# Altium schematic sheet WSN_project_Gateway.SchDoc
size A4; SheetNumber: 1; SheetTotal: 1
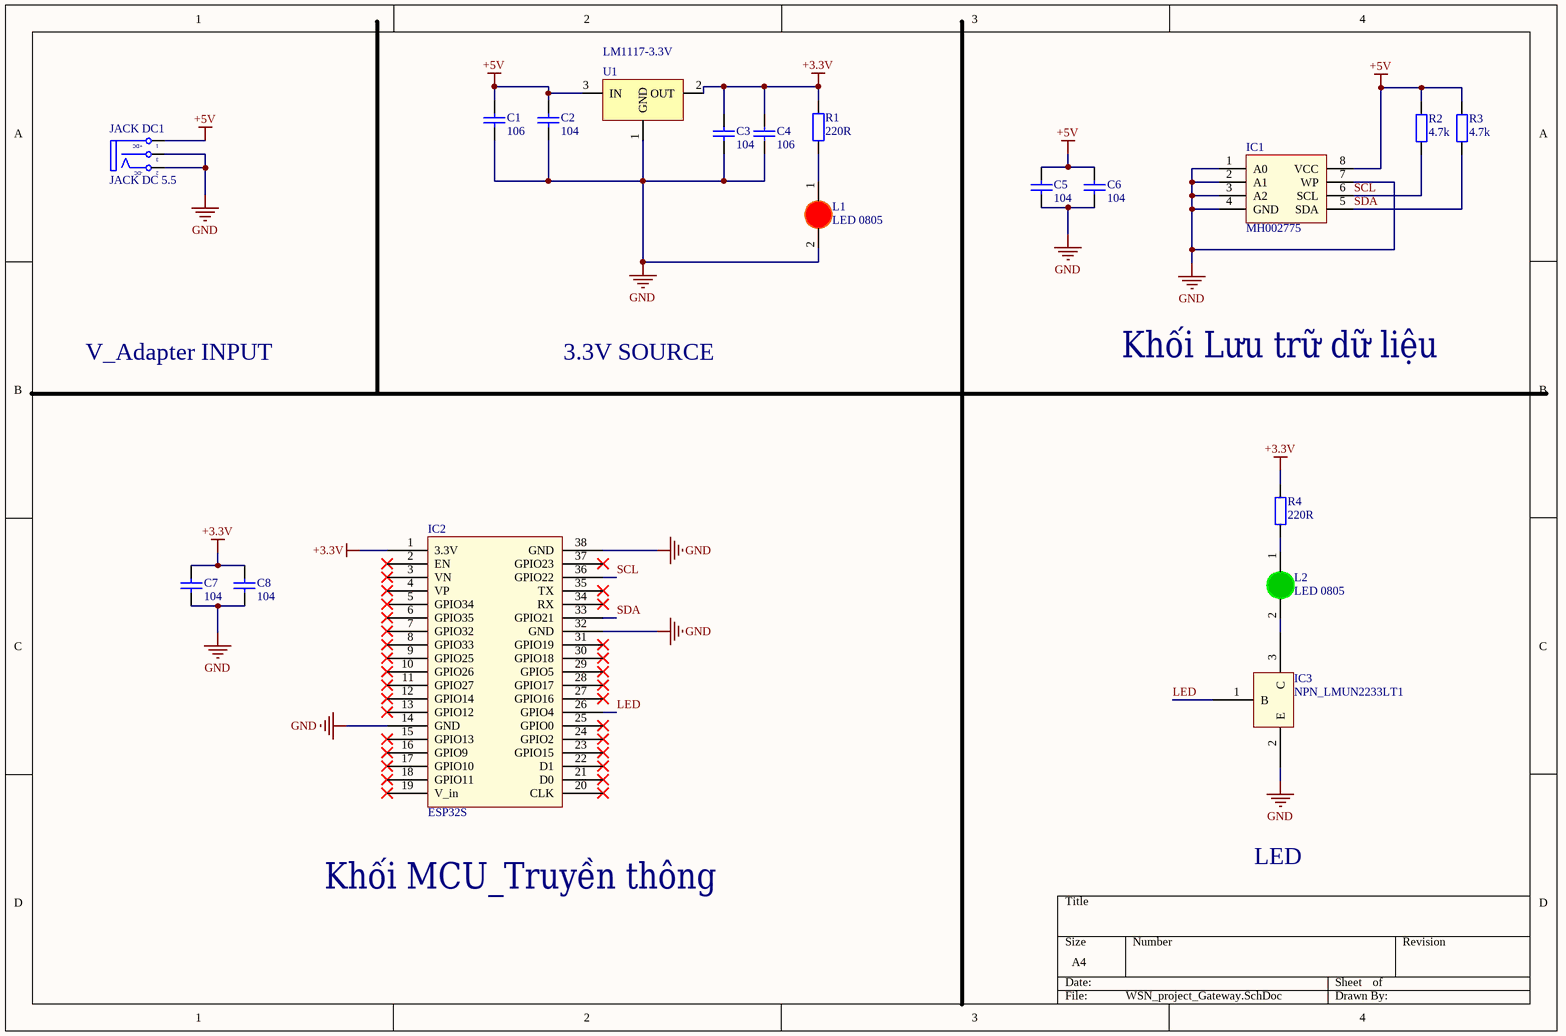
[diagram p0: WSN_project_Gateway.SchDoc]

## Parts
C1  106  [tu 1206]
C2  104  [tu 1206]
C3  104  [tu 1206]
C4  106  [tu 1206]
C5  104  [tu 1206]
C6  104  [tu 1206]
C7  104  [tu 1206]
C8  104  [tu 1206]
IC1  MH002775  [DIP8]
IC2  ESP32S  [ESP32 DEVKIT]
IC3  NPN_LMUN2233LT1  [SOT23_LMUN2233_trans]
JACK_DC1  JACK DC 5.5  [JACK DC 5.5]
L1  LED 0805  [LED-0805-Red]
L2  LED 0805  [LED-1206-Green]
R1  220R  [tro smd 0805]
R2  4.7k  [tro smd 0805]
R3  4.7k  [tro smd 0805]
R4  220R  [tro smd 0805]
U1  LM1117-3.3V  [LM1117-SOP]

## Nets
+3.3V: C3.1 C4.2 C7.1 C8.1 IC2.1(3.3V) R1.1 R4.2 U1.2(OUT)
+5V: C1.2 C2.1 C5.1 C6.1 IC1.8(VCC) JACK_DC1.1(T) R2.2 R3.2 U1.3(IN)
GND: C1.1 C2.2 C3.2 C4.1 C5.2 C6.2 C7.2 C8.2 IC1.1(A0) IC1.2(A1) IC1.3(A2) IC1.4(GND) IC1.7(WP) IC2.14(GND) IC2.32(GND) IC2.38(GND) IC3.2(E) JACK_DC1.2(TN) JACK_DC1.3(S) L1.2(K) U1.1(GND)
LED: IC2.26(GPIO4) IC3.1(B)
SCL: IC1.6(SCL) IC2.36(GPIO22) R2.1
SDA: IC1.5(SDA) IC2.33(GPIO21) R3.1
NetIC3_3: IC3.3(C) L2.2(K)
NetL1_1: L1.1(A) R1.2
NetL2_1: L2.1(A) R4.1

Not connected (* = marked no-connect by the designer): IC2 2(EN)* 3(VN)* 4(VP)* 5(GPIO34)* 6(GPIO35)* 7(GPIO32)* 8(GPIO33)* 9(GPIO25)* 10(GPIO26)* 11(GPIO27)* 12(GPIO14)* 13(GPIO12)* 15(GPIO13)* 16(GPIO9)* 17(GPIO10)* 18(GPIO11)* 19(V_in)* 20(CLK)* 21(D0)* 22(D1)* 23(GPIO15)* 24(GPIO2)* 25(GPIO0)* 27(GPIO16)* 28(GPIO17)* 29(GPIO5)* 30(GPIO18)* 31(GPIO19)* 34(RX)* 35(TX)* 37(GPIO23)*

## Notes on the sheet
- V_Adapter INPUT
- 3.3V SOURCE
- Khối Lưu trữ dữ liệu
- Khối MCU_Truyền thông
- LED
- (in symbol JACK DC 5.5) +DC; -DC

## Library data of the parts
C1 C4 = Tu 1206 106 16V 20%: Dán; Don_Vi: Con; So_Chan: 2; Ten_Linh_Kien: Tụ 1206 106-10uF 20% 16V; Ma_Hang: MH004541; Chung_Loai: Dán; Kieu_Chan: *
C2 C3 C5-C8 = Tu 1206 104 50V 20%: Dán; Don_Vi: Con; So_Chan: 2; Ten_Linh_Kien: Tụ 1206 104-0.1uF 20% 50V; Ma_Hang: MH004544; Chung_Loai: Dán; Kieu_Chan: *
IC1 = AT24C01 DIP8 EEPROM: Cắm; Ten_Linh_Kien: AT24C01 DIP8 EEPROM 1KBIT; Don_Vi: Con; Kieu_Chan: *; Ghi_Chu: *; Ma_Hang: MH002775; Chung_Loai: Cắm
JACK_DC1 = JACK DC 5.5: Value: Jac DC
L1 = LED 0805 Do: Dán; Don_Vi: Con; Ma_Hang: MH000897; Ten_Linh_Kien: LED 0805 Màu Đỏ (Red); Ghi_Chu: *; Kieu_Chan: *; Chung_Loai: Dán
L2 = LED 1206 Xanh La: Dán; Don_Vi: Con; Ma_Hang: MH002947; Ten_Linh_Kien: LED1206 Màu Xanh Lá (Green); Ghi_Chu: *; Kieu_Chan: *; Chung_Loai: Dán
R1 = Tro 0805 1% 0.5R: Dán; Don_Vi: Con; So_Chan: 2; Ten_Linh_Kien: Trở 0805 1% 0.5R; Ma_Hang: MH005465; Chung_Loai: Dán; Kieu_Chan: *
R2 R3 = Tro 0805 5% 4.7k: Dán; Don_Vi: Con; So_Chan: 2; Ten_Linh_Kien: Trở 0805 5% 4.7k; Ma_Hang: MH005307; Chung_Loai: Dán; Kieu_Chan: *
R4 = Tro 0805 5% 220R: Dán; Don_Vi: Con; So_Chan: 2; Ten_Linh_Kien: Trở 0805 5% 220R; Ma_Hang: MH005259; Chung_Loai: Dán; Kieu_Chan: *
U1 = LM1117: 800mA Low-Dropout Linear Regulator; Creator: Nguyen Ba Bien; Website: http://group3i.net